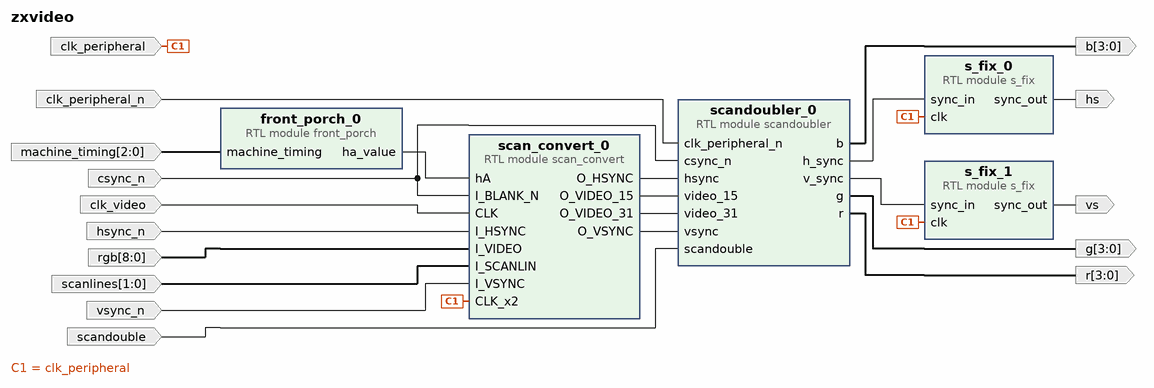
[diagram p0: block diagram of the top level]
# Vivado block design zxvideo, xc7a100tcsg324-1, Vivado 2021.2
create_bd_design zxvideo

create_bd_port -dir I -type clk clk_peripheral
set_property -dict {CONFIG.FREQ_HZ 28000000} [get_bd_ports clk_peripheral]
create_bd_port -dir I -type clk clk_video
set_property -dict {CONFIG.FREQ_HZ 14000000} [get_bd_ports clk_video]
create_bd_port -dir I -type clk clk_peripheral_n
set_property -dict {CONFIG.FREQ_HZ 28000000} [get_bd_ports clk_peripheral_n]
create_bd_port -dir I -from 8 -to 0 -type data rgb
create_bd_port -dir I hsync_n
create_bd_port -dir I vsync_n
create_bd_port -dir I csync_n
create_bd_port -dir I -from 1 -to 0 scanlines
create_bd_port -dir I scandouble
create_bd_port -dir O vs
create_bd_port -dir O hs
create_bd_port -dir O -from 3 -to 0 r
create_bd_port -dir O -from 3 -to 0 g
create_bd_port -dir O -from 3 -to 0 b
create_bd_port -dir I -from 2 -to 0 machine_timing

create_bd_cell -type module -reference front_porch front_porch_0
create_bd_cell -type module -reference scan_convert scan_convert_0
set_property -dict [list \
  CONFIG.clength 704 \
  CONFIG.cstart 76 \
  CONFIG.hB 64 \
  CONFIG.hC 80 \
  CONFIG.hD 704 \
  CONFIG.vB 4 \
  CONFIG.vC 10 \
  CONFIG.vD 568 \
] [get_bd_cells scan_convert_0]
create_bd_cell -type module -reference scandoubler scandoubler_0
create_bd_cell -type module -reference s_fix s_fix_0
create_bd_cell -type module -reference s_fix s_fix_1

# ---- connections ----

connect_bd_net [get_bd_ports clk_peripheral] [get_bd_pins scan_convert_0/CLK_x2] [get_bd_pins s_fix_0/clk] [get_bd_pins s_fix_1/clk]
connect_bd_net [get_bd_ports clk_peripheral_n] [get_bd_pins scandoubler_0/clk_peripheral_n]
connect_bd_net [get_bd_ports clk_video] [get_bd_pins scan_convert_0/CLK]
connect_bd_net [get_bd_ports csync_n] [get_bd_pins scan_convert_0/I_BLANK_N] [get_bd_pins scandoubler_0/csync_n]
connect_bd_net [get_bd_pins front_porch_0/ha_value] [get_bd_pins scan_convert_0/hA]
connect_bd_net [get_bd_ports hsync_n] [get_bd_pins scan_convert_0/I_HSYNC]
connect_bd_net [get_bd_ports machine_timing] [get_bd_pins front_porch_0/machine_timing]
connect_bd_net [get_bd_ports rgb] [get_bd_pins scan_convert_0/I_VIDEO]
connect_bd_net [get_bd_pins s_fix_0/sync_out] [get_bd_ports hs]
connect_bd_net [get_bd_pins s_fix_1/sync_out] [get_bd_ports vs]
connect_bd_net [get_bd_pins scan_convert_0/O_HSYNC] [get_bd_pins scandoubler_0/hsync]
connect_bd_net [get_bd_pins scan_convert_0/O_VIDEO_15] [get_bd_pins scandoubler_0/video_15]
connect_bd_net [get_bd_pins scan_convert_0/O_VIDEO_31] [get_bd_pins scandoubler_0/video_31]
connect_bd_net [get_bd_pins scan_convert_0/O_VSYNC] [get_bd_pins scandoubler_0/vsync]
connect_bd_net [get_bd_ports scandouble] [get_bd_pins scandoubler_0/scandouble]
connect_bd_net [get_bd_pins scandoubler_0/b] [get_bd_ports b]
connect_bd_net [get_bd_pins scandoubler_0/g] [get_bd_ports g]
connect_bd_net [get_bd_pins scandoubler_0/h_sync] [get_bd_pins s_fix_0/sync_in]
connect_bd_net [get_bd_pins scandoubler_0/r] [get_bd_ports r]
connect_bd_net [get_bd_pins scandoubler_0/v_sync] [get_bd_pins s_fix_1/sync_in]
connect_bd_net [get_bd_ports scanlines] [get_bd_pins scan_convert_0/I_SCANLIN]
connect_bd_net [get_bd_ports vsync_n] [get_bd_pins scan_convert_0/I_VSYNC]

validate_bd_design
save_bd_design
